# EasyEDA schematic XentrinoBoard-ESP32-WROOM-2WD-2020.v1.2.json
TITLE: esp32-2wd; REV: 1.0; Date: 2020-11-08; Sheet: 1/1; Drawn By: nimro; Company: Circuit Customizer
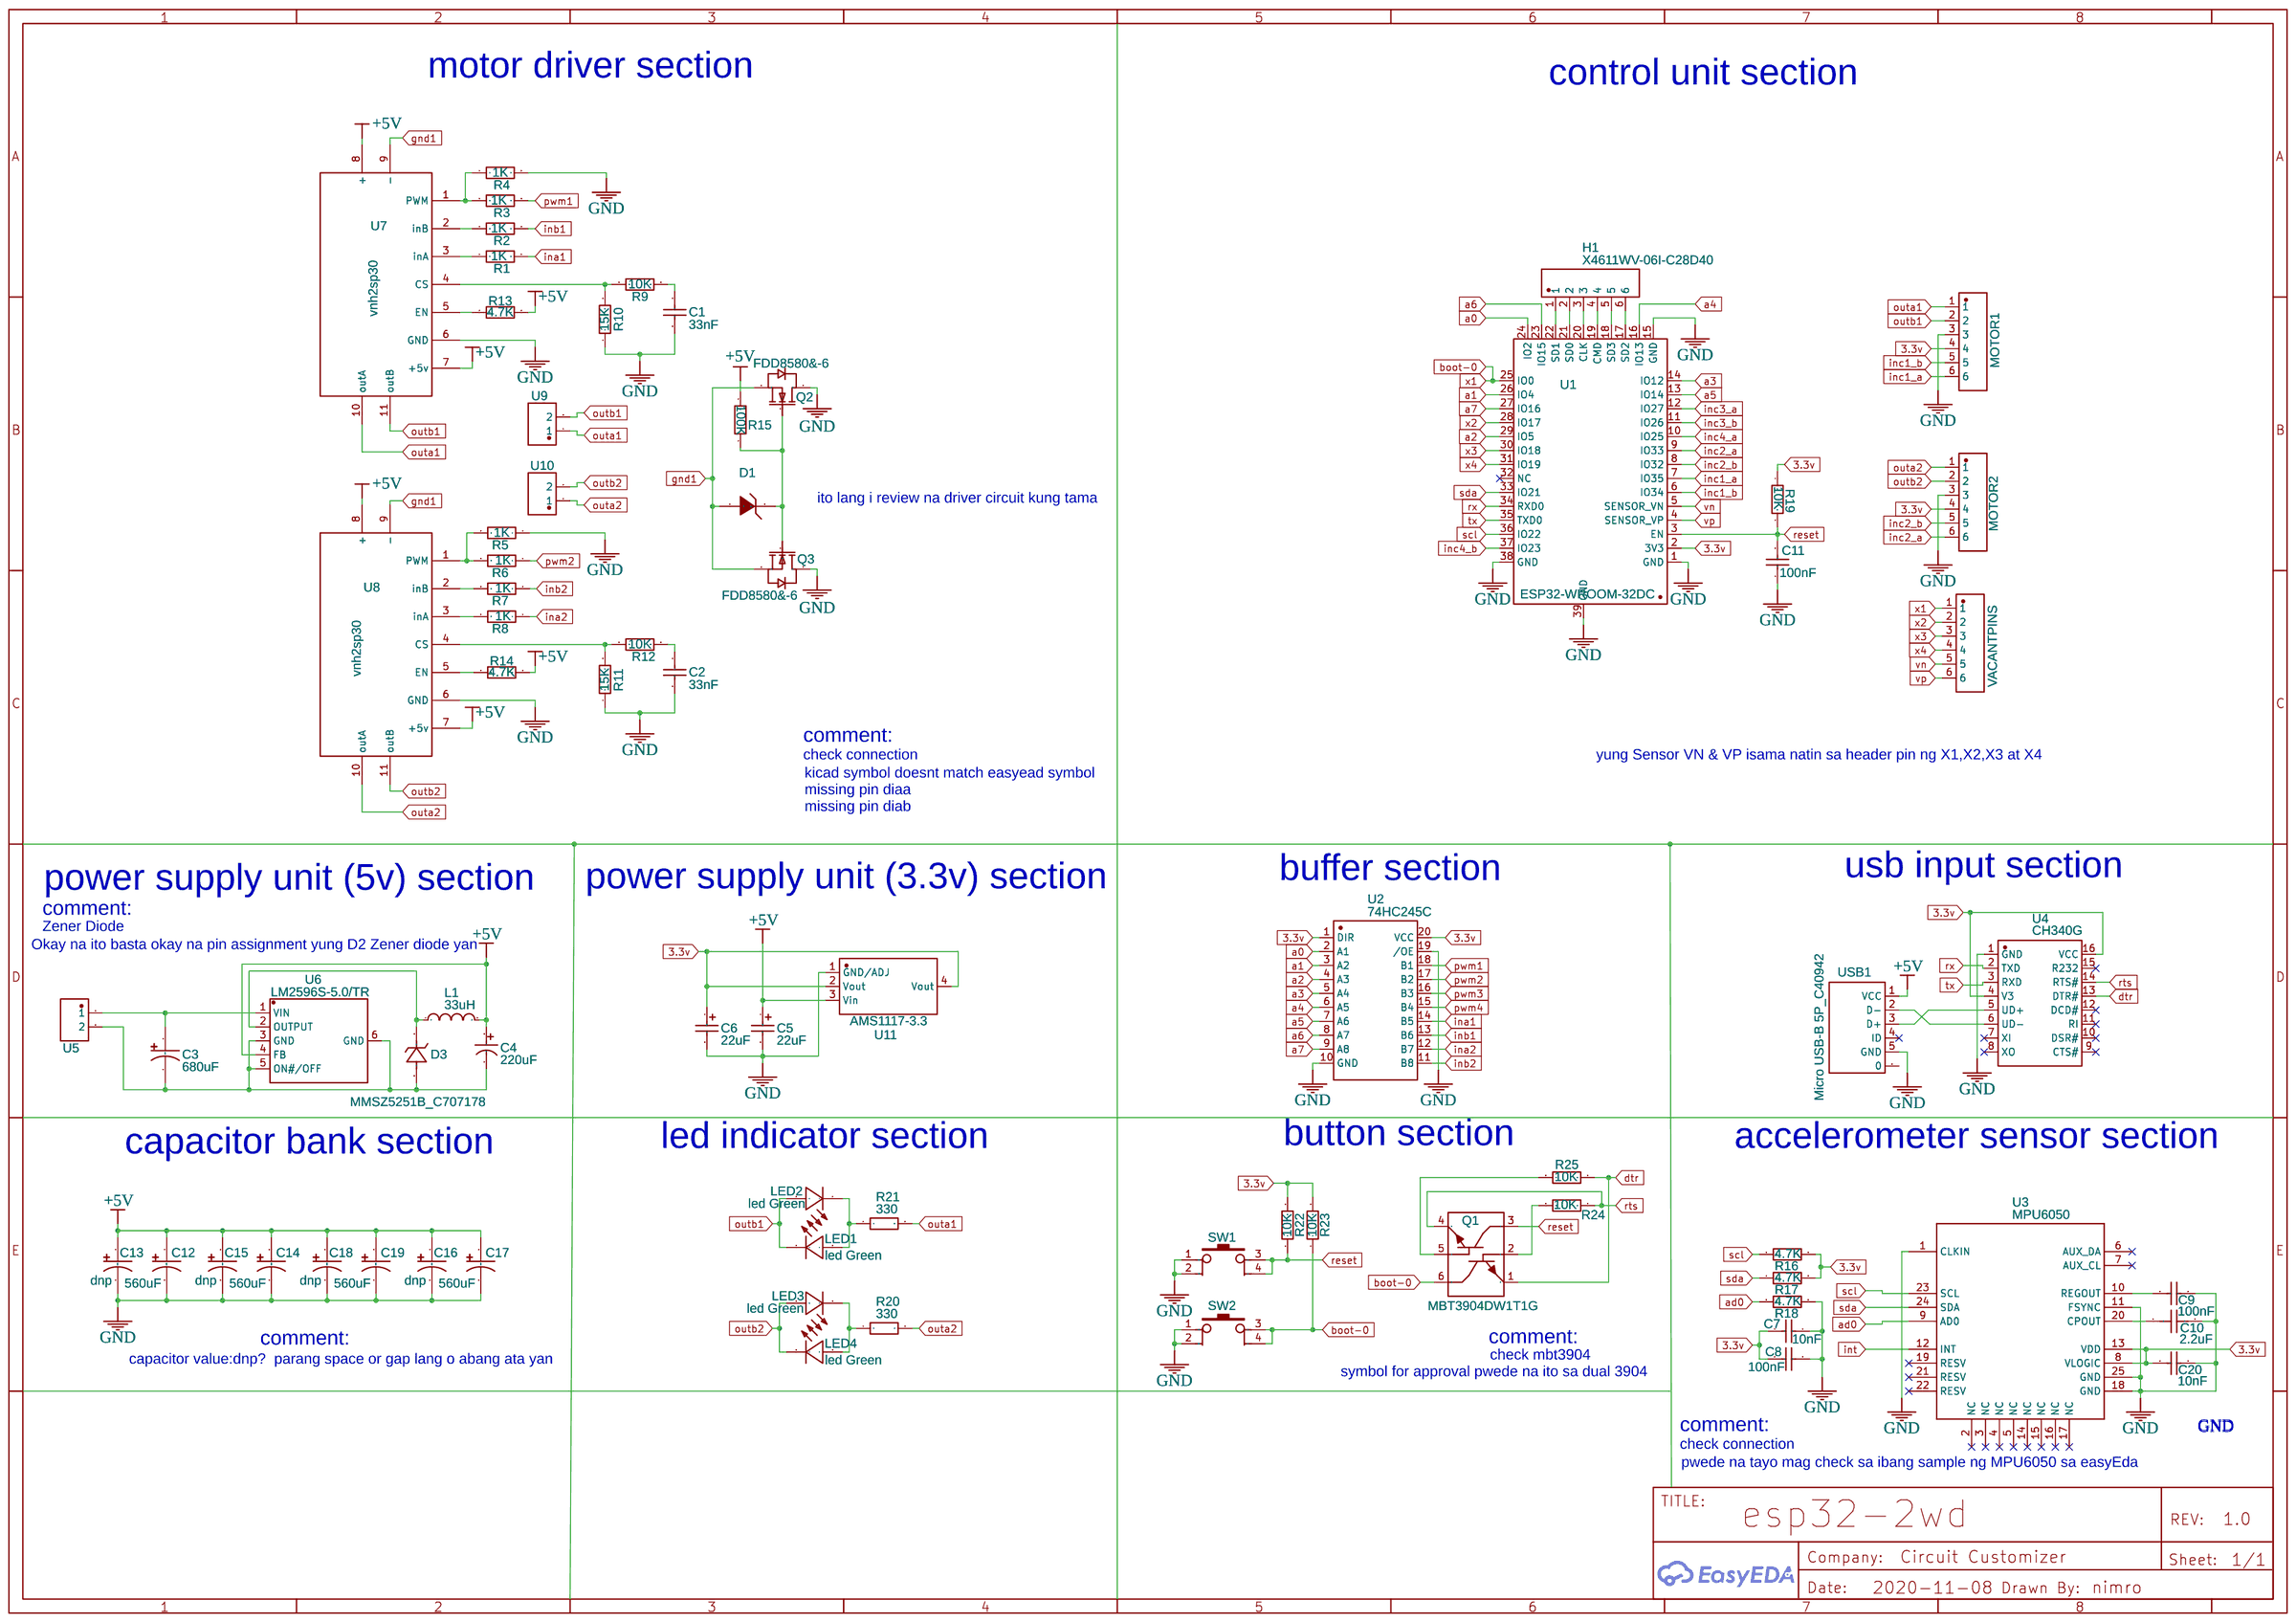
[diagram p0: schematic sheet]

## Parts
C1  33nF  [C0805]
C2  33nF  [C0805]
C3  680uF  [CAP-SMD_BD10.0-L10.3-W10.3-FD]
C4  220uF  [CAP-SMD_BD8.0-L8.3-W8.3-FD]
C5  22uF  [CAP-SMD_L3.2-W1.6-R-RD]
C6  22uF  [CAP-SMD_L3.2-W1.6-R-RD]
C7  10nF  [C0805]
C8  100nF  [C0805]
C9  100nF  [C0805]
C10  2.2uF  [C0603]
C11  100nF  [C0805]
C12  560uF  [CAP-TH_BD6.3-P2.50-D1.0-FD]
C13  dnp  [CAP-TH_BD6.3-P2.50-D1.0-FD]
C14  560uF  [CAP-TH_BD6.3-P2.50-D1.0-FD]
C15  dnp  [CAP-TH_BD6.3-P2.50-D1.0-FD]
C16  dnp  [CAP-TH_BD6.3-P2.50-D1.0-FD]
C17  560uF  [CAP-TH_BD6.3-P2.50-D1.0-FD]
C18  dnp  [CAP-TH_BD6.3-P2.50-D1.0-FD]
C19  560uF  [CAP-TH_BD6.3-P2.50-D1.0-FD]
C20  10nF  [C0805]
D1  BZT52C2V7-7-F  [SOD-123_L2.7-W1.6-LS3.7-RD]
D3  MMSZ5251B_C707178  [SOD-123_L2.7-W1.6-LS3.7-RD]
H1  X4611WV-06I-C28D40  [HDR-TH_6P-P2.00-V-M]
L1  33uH  [IND-SMD_L8.0-W8.0_1217AS]
LED1  led Green  [LED1206-RD]
LED2  led Green  [LED1206-RD]
LED3  led Green  [LED1206-RD]
LED4  led Green  [LED1206-RD]
MOTOR1  X4611WV-06I-C28D40  [HDR-TH_6P-P2.00-V-M]
MOTOR2  X4611WV-06I-C28D40  [HDR-TH_6P-P2.00-V-M]
Q1  MBT3904DW1T1G  [SOT-363_L2.0-W1.3-P0.65-LS2.1-TL]
Q2  FDD8580&-6  [TO-252-2_L6.6-W6.1-P4.57-LS9.9-BR-CW]
Q3  FDD8580&-6  [TO-252-2_L6.6-W6.1-P4.57-LS9.9-BR-CW]
R1  1K  [R0805]
R2  1K  [R0805]
R3  1K  [R0805]
R4  1K  [R0805]
R5  1K  [R0805]
R6  1K  [R0805]
R7  1K  [R0805]
R8  1K  [R0805]
R9  10K  [R0603]
R10  15K  [R0805]
R11  15K  [R0805]
R12  10K  [R0603]
R13  4.7K  [R0603]
R14  4.7K  [R0603]
R15  100K  [R0805]
R16  4.7K  [R0603]
R17  4.7K  [R0603]
R18  4.7K  [R0603]
R19  10K  [R0603]
R20  330  [R0603]
R21  330  [R0603]
R22  10K  [R0603]
R23  10K  [R0603]
R24  10K  [R0603]
R25  10K  [R0603]
SW1  Button-SMD-4.5x4.5x5.5  [SW-SMD_4PIN-L4.50-W4.50]
SW2  Button-SMD-4.5x4.5x5.5  [SW-SMD_4PIN-L4.50-W4.50]
U1  ESP32-WROOM-32DC  [WIFIM-SMD_38P-L25.5-W18.0-P1.27]
U2  74HC245C  [TSSOP-20_L6.5-W4.4-P0.65-LS6.4-BL]
U3  MPU6050  [QFN50P400X400X95-25T265X275N]
U4  CH340G  [SOIC-16_L9.9-W3.9-P1.27-LS6.0-BR]
U5  ED555/2DS  [CONN-TH_2P-P3.50_ED555/2DS]
U6  LM2596S-5.0/TR  [TO-263-5_L10.6-W9.6-P1.70-LS15.9-TL]
U7  vnh2sp30  [VNH2SP30-PACK]
U8  vnh2sp30  [VNH2SP30-PACK]
U9  ED555/2DS  [CONN-TH_2P-P3.50_ED555/2DS]
U10  ED555/2DS  [CONN-TH_2P-P3.50_ED555/2DS]
U11  AMS1117-3.3  [SOT-223-3_L6.5-W3.4-P2.30-LS7.0-BR]
USB1  Micro USB-B 5P_C40942  [MICRO-USB-SMD_5P-P0.65-H-M_MICRO-USB-5P]
VACANTPINS  X4611WV-06I-C28D40  [HDR-TH_6P-P2.00-V-M]

## Library data of the parts
C1 C2 = 0805B333K500NT: Supplier: LCSC; Manufacturer: FH; LCSC Assembly: Yes; Supplier Part: C1739; SMT Type: Basic
C3 = EEEFK1E681SP: Supplier: LCSC; Supplier Part: C413667; Manufacturer: PANASONIC; Contributor: LCSC; LCSC Assembly: Yes; SMT Type: Extend
C4 = DV221M025F105R: Supplier: LCSC; Manufacturer: CapXon; Supplier Part: C65222
C5 C6 = TAJA226K006RNJ: Supplier: LCSC; Manufacturer: AVX; Supplier Part: C7182; LCSC Assembly: Yes; SMT Type: Extend
C7 = CL21C103JBFNNNE: Supplier: LCSC; Manufacturer: SAMSUNG; Supplier Part: C27071; LCSC Assembly: Yes; SMT Type: Extend
C8 C9 C11 C20 = CL21B104JBCNNNC: Supplier: LCSC; Manufacturer: SAMSUNG; Supplier Part: C62912; LCSC Assembly: Yes; SMT Type: Extend
C10 = CL10A225KA8NNNC: Supplier: LCSC; Manufacturer: SAMSUNG; Supplier Part: C57895; LCSC Assembly: Yes; SMT Type: Extend
C12-C19 = PC0J561ME080A00CR0: Supplier: LCSC; Supplier Part: C190902; Manufacturer: Changzhou Huawei Elec; Contributor: LCSC
D1 = BZT52C2V7-7-F: Supplier: LCSC; Manufacturer: DIODES; Contributor: LCSC; Supplier Part: C151624
D3 = MMSZ5251B_C707178: Supplier: LCSC; Supplier Part: C707178; Manufacturer: Slkor(SLKORMICRO Elec.); Manufacturer Part: MMSZ5251B; Contributor: LCSC
H1 MOTOR1 MOTOR2 VACANTPINS = X4611WV-06I-C28D40: Supplier: LCSC; Supplier Part: C706993; Manufacturer: XKB Connectivity; Contributor: LCSC
L1 = SWPA8040S330MT: Supplier: LCSC; Manufacturer: Sunlord; Supplier Part: C83467
LED1-LED4 = led Green: Supplier: LCSC; Manufacturer: KENTO; image: //image.lceda.cn/szlcsc/C14641.jpg; Supplier Part: C14641; LCSC Assembly: Yes; SMT Type: Extend
Q1 = MBT3904DW1T1G: Supplier: LCSC; Manufacturer: ON; Supplier Part: C110150; LCSC Assembly: Yes; SMT Type: Extend
Q2 Q3 = FDD8580&amp;-6: Supplier: LCSC; Supplier Part: C693389; Manufacturer: VBsemi Elec; Contributor: LCSC
R1-R8 = RT0805FRD071KL: Supplier: LCSC; Manufacturer: YAGEO; Contributor: LCSC; Supplier Part: C136907
R9 R12 R19 R22-R25 = LE03WAJ0103T5E: Supplier: LCSC; Manufacturer: UniOhm; Supplier Part: C81087; LCSC Assembly: Yes; SMT Type: Extend
R10 R11 = RK73H2ATTD1502F: Supplier: LCSC; Manufacturer: KOA; Contributor: LCSC; Supplier Part: C160068
R13 R14 R16-R18 = RC0603JR-074K7L: Supplier: LCSC; Manufacturer: YAGEO; Supplier Part: C105428; LCSC Assembly: Yes; SMT Type: Extend
R15 = MCWF08U1003BTL: Supplier: LCSC; Supplier Part: C241287; Manufacturer: Multicomp; Contributor: LCSC
R20 R21 = 330R 5% 0603: Supplier: LCSC; Manufacturer: FH; Supplier Part: C22104
SW1 SW2 = Button-SMD-4.5x4.5x5.5: Supplier Part: C71849; Supplier: LCSC; Manufacturer: BBJ; Manufacturer Part: 4.5*4.5*5.5 Plastic head,260G, 0.25mm,SMD
U1 = ESP32-WROOM-32DC: Supplier: LCSC; Supplier Part: C473013; Manufacturer: Espressif Systems; Contributor: LCSC
U2 = 74HC245C: Supplier: LCSC; Manufacturer: FM; Supplier Part: C126198; LCSC Assembly: Yes; SMT Type: Extend
U3 = MPU6050
U4 = CH340G: Supplier: LCSC; Manufacturer: WCH; LCSC Assembly: Yes; image: //image.lceda.cn/szlcsc/C14267.jpg; Supplier Part: C14267; SMT Type: Basic
U5 U9 U10 = ED555/2DS: Supplier: LCSC; Supplier Part: C98754; Manufacturer: On-Shore Tech; Contributor: LCSC
U6 = LM2596S-5.0/TR: Supplier: LCSC; Supplier Part: C194349; Manufacturer: HGSEMI; Contributor: LCSC; LCSC Assembly: Yes; SMT Type: Extend
U7 U8 = vnh2sp30: Contributor: gtf.crimea
U11 = AMS1117-3.3: sourceId: dwIGgezVh; Supplier: LCSC; Manufacturer: AMS; LCSC Assembly: Yes; image: //image.lceda.cn/szlcsc/C6186.jpg; Supplier Part: C6186; SMT Type: Basic
USB1 = Micro USB-B 5P_C40942: Supplier: LCSC; Manufacturer: ValuePro; image: //image.lceda.cn/szlcsc/C40942.jpg; Supplier Part: C40942

## Nets
3.3v: C6.1 C7.1 C8.1 C20.1 MOTOR1.4 MOTOR2.4 R16.2 R17.2 R19.1 R22.2 R23.2 U1.2(3V3) U2.1(DIR) U2.20(VCC) U3.8(VLOGIC) U3.13(VDD) U4.4(V3) U4.16(VCC) U11.2(Vout) U11.4(Vout)
+5V: C4.1 C5.1 C12.1 C13.1 C14.1 C15.1 C16.1 C17.1 C18.1 C19.1 L1.2 R13.2 R14.2 R15.2 U6.4(FB) U7.7(+5v) U7.8(+) U8.7(+5v) U8.8(+) U11.3(Vin) USB1.1(VCC)
GND: C1.1 C2.1 C5.2 C6.2 C7.2 C8.2 C9.2 C10.2 C11.1 C12.2 C13.2 C14.2 C15.2 C16.2 C17.2 C18.2 C19.2 C20.2 MOTOR1.3 MOTOR2.3 Q2.2(D) Q3.2(D) R4.2 R5.1 R10.1 R11.1 R18.2 SW1.1 SW1.2 SW2.1 SW2.2 U1.1(GND) U1.15(GND) U1.38(GND) U1.39(GND) U2.10(GND) U2.19(/OE) U3.1(CLKIN) U3.11(FSYNC) U3.18(GND) U3.25(GND) U4.1(GND) U7.6(GND) U8.6(GND) U11.1(GND/ADJ) USB1.5(GND)
gnd1: D1.2(A) Q2.3(S) Q3.3(S) U7.9(-) U8.9(-)
a0: U1.24(IO2) U2.2(A1)
a1: U1.26(IO4) U2.3(A2)
a2: U1.29(IO5) U2.4(A3)
a3: U1.14(IO12) U2.5(A4)
a4: U1.16(IO13) U2.6(A5)
a5: U1.13(IO14) U2.7(A6)
a6: U1.23(IO15) U2.8(A7)
a7: U1.27(IO16) U2.9(A8)
ad0: R18.1 U3.9(AD0)
boot-0: Q1.6 R23.1 SW2.3 SW2.4 U1.25(IO0) VACANTPINS.1
dtr: Q1.1 R25.1 U4.13(DTR#)
ina1: R1.2 U2.14(B5)
ina2: R8.1 U2.12(B7)
inb1: R2.2 U2.13(B6)
inb2: R7.1 U2.11(B8)
inc1_a: MOTOR1.6 U1.7(IO35)
inc1_b: MOTOR1.5 U1.6(IO34)
inc2_a: MOTOR2.6 U1.9(IO33)
inc2_b: MOTOR2.5 U1.8(IO32)
inc3_a: U1.12(IO27)
inc3_b: U1.11(IO26)
inc4_a: U1.10(IO25)
inc4_b: U1.37(IO23)
int: U3.12(INT)
outa1: MOTOR1.1 R21.2 U7.10(outA) U9.1
outa2: MOTOR2.1 R20.2 U8.10(outA) U10.1
outb1: LED1.1(-) LED2.2(+) MOTOR1.2 U7.11(outB) U9.2
outb2: LED3.2(+) LED4.1(-) MOTOR2.2 U8.11(outB) U10.2
pwm1: R3.2 U2.18(B1)
pwm2: R6.1 U2.17(B2)
pwm3: U2.16(B3)
pwm4: U2.15(B4)
reset: C11.2 Q1.3 R19.2 R22.1 SW1.3 SW1.4 U1.3(EN)
rts: Q1.4 R24.1 U4.14(RTS#)
rx: U1.34(RXD0) U4.2(TXD)
scl: R16.1 U1.36(IO22) U3.23(SCL)
sda: R17.1 U1.33(IO21) U3.24(SDA)
tx: U1.35(TXD0) U4.3(RXD)
vn: U1.5(SENSOR_VN) VACANTPINS.5
vp: U1.4(SENSOR_VP) VACANTPINS.6
x2: U1.28(IO17) VACANTPINS.2
x3: U1.30(IO18) VACANTPINS.3
x4: U1.31(IO19) VACANTPINS.4
Net-(C1-2): C1.2 R9.2
Net-(C2-2): C2.2 R12.2
Net-(C3-1): C3.1 U5.1 U6.1(VIN)
Net-(C3-2): C3.2 C4.2 D3.2(A) U5.2 U6.3(GND) U6.5(ON#/OFF) U6.6(GND)
Net-(C9-1): C9.1 U3.10(REGOUT)
Net-(C10-1): C10.1 U3.20(CPOUT)
Net-(D1-1): D1.1(K) Q2.1(G) Q3.1(G) R15.1
Net-(D3-1): D3.1(K) L1.1 U6.2(OUTPUT)
Net-(H1-1): H1.1 U1.22(SD1)
Net-(H1-2): H1.2 U1.21(SD0)
Net-(H1-3): H1.3 U1.20(CLK)
Net-(H1-4): H1.4 U1.19(CMD)
Net-(H1-5): H1.5 U1.18(SD3)
Net-(H1-6): H1.6 U1.17(SD2)
Net-(LED1-2): LED1.2(+) LED2.1(-) R21.1
Net-(LED3-1): LED3.1(-) LED4.2(+) R20.1
Net-(Q1-2): Q1.2 R24.2
Net-(Q1-5): Q1.5 R25.2
Net-(R1-1): R1.1 U7.3(inA)
Net-(R2-1): R2.1 U7.2(inB)
Net-(R3-1): R3.1 R4.1 U7.1(PWM)
Net-(R5-2): R5.2 R6.2 U8.1(PWM)
Net-(R7-2): R7.2 U8.2(inB)
Net-(R8-2): R8.2 U8.3(inA)
Net-(R9-1): R9.1 R10.2 U7.4(CS)
Net-(R11-2): R11.2 R12.1 U8.4(CS)
Net-(R13-1): R13.1 U7.5(EN)
Net-(R14-1): R14.1 U8.5(EN)
Net-(U4-5): U4.5(UD+) USB1.3(D+)
Net-(U4-6): U4.6(UD-) USB1.2(D-)

Not connected (* = marked no-connect by the designer): U1 32(NC)*; U3 2(NC)* 3(NC)* 4(NC)* 5(NC)* 6(AUX_DA)* 7(AUX_CL)* 14(NC)* 15(NC)* 16(NC)* 17(NC)* 19(RESV)* 21(RESV)* 22(RESV)*; U4 7(XI)* 8(XO)* 9(CTS#)* 10(DSR#)* 11(RI)* 12(DCD#)* 15(R232)*; USB1 0 4(ID)*

## Notes on the sheet
- motor driver section
- control unit section
- ito lang i review na driver circuit kung tama
- comment:
- check connection
- yung Sensor VN & VP isama natin sa header pin ng X1,X2,X3 at X4
- kicad symbol doesnt match easyead symbol
- missing pin diaa
- missing pin diab
- usb input section
- power supply unit (5v) section
- power supply unit (3.3v) section
- buffer section
- comment:
- Zener Diode
- Okay na ito basta okay na pin assignment yung D2 Zener diode yan
- capacitor bank section
- led indicator section
- button section
- accelerometer sensor section
- comment:
- comment:
- check mbt3904
- capacitor value:dnp?  parang space or gap lang o abang ata yan
- symbol for approval pwede na ito sa dual 3904
- comment:
- GND
- GND
- GND
- check connection
- pwede na tayo mag check sa ibang sample ng MPU6050 sa easyEda
